# Altium schematic sheet adc-digital.SchDoc: ADC - Digital
size Letter; CheckedBy: J. Brinton; CompanyName: Signal Laboratories, Inc.; DrawnBy: J. Brinton; Engineer: J. Brinton; Address1: 3479 Edison Way; Address2: Menlo Park CA 94025; Address3: +1 (877) 778-8435; Address4: siglabs.com; Revision: 3; SheetNumber: 19; SheetTotal: 49
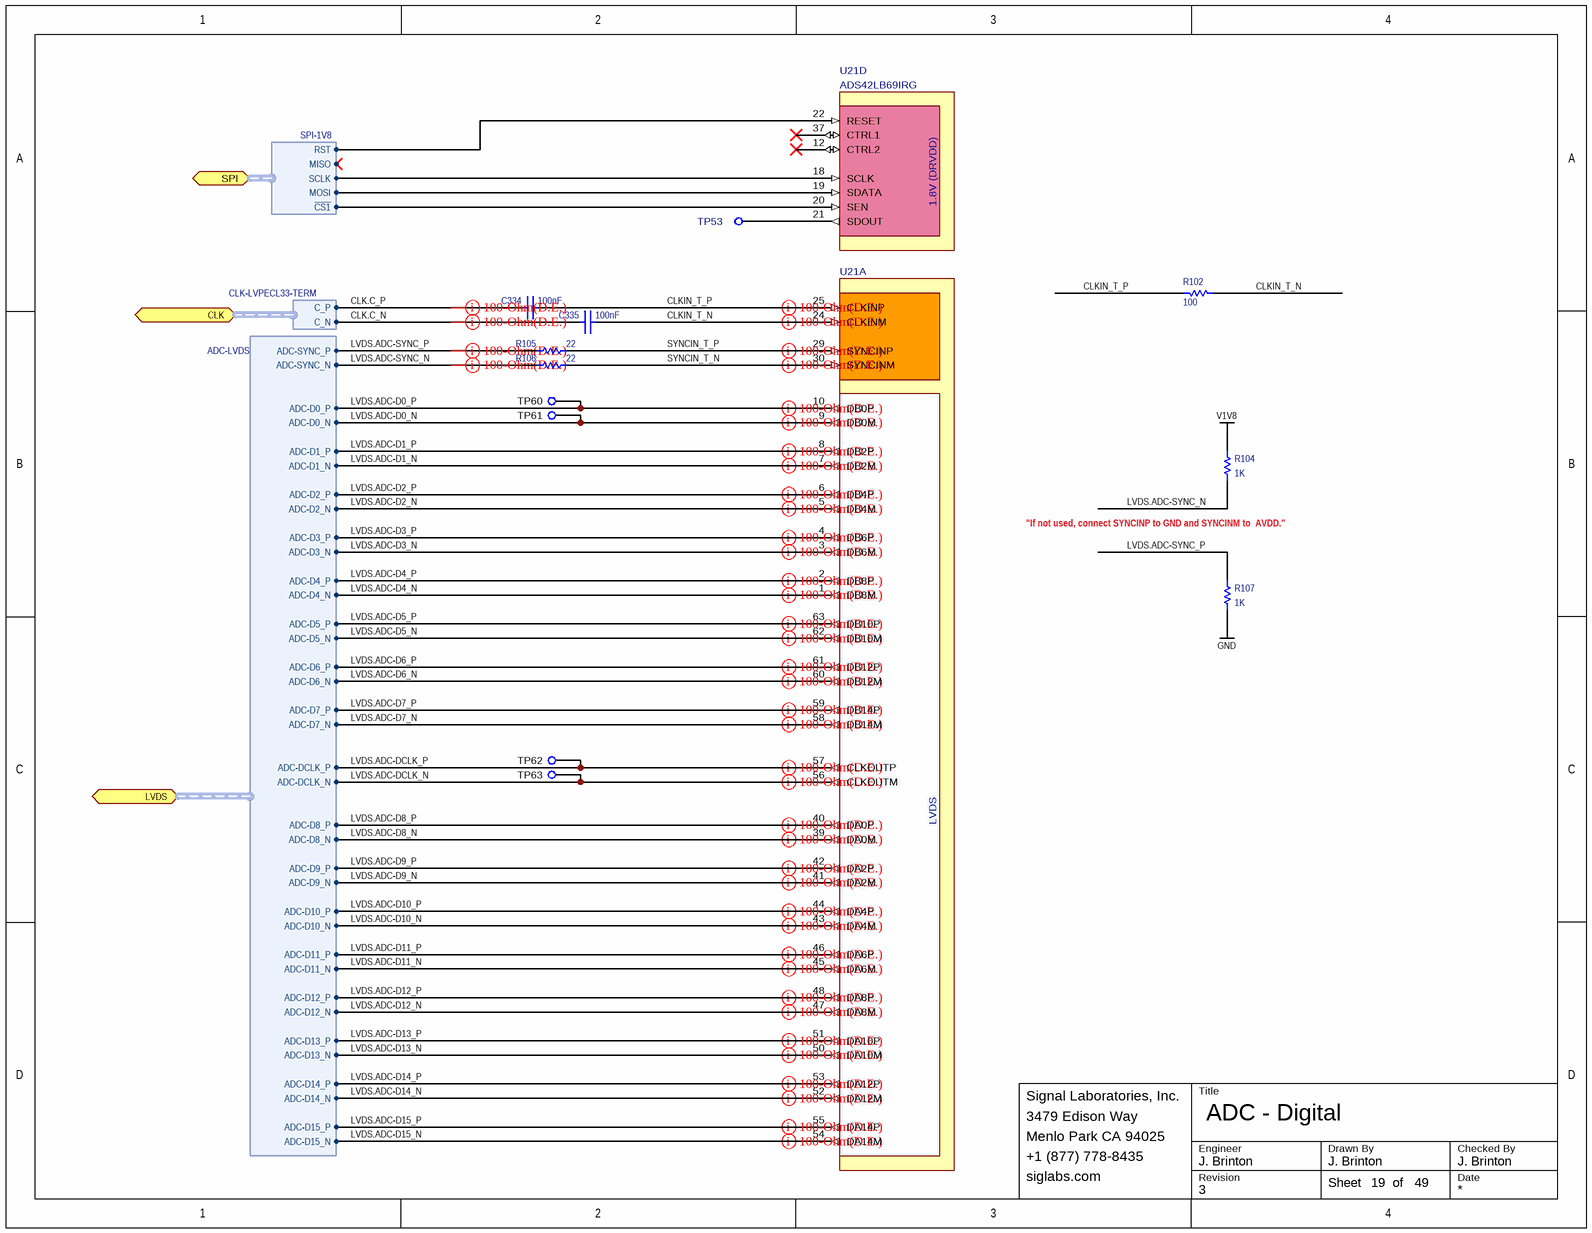
[diagram p0: adc-digital.SchDoc]

## Parts
C334  value 100nF  [CAPC100X50X55L25N]  (hidden comment: GRM155R71C104KA88J)
C335  value 100nF  [CAPC100X50X55L25N]  (hidden comment: GRM155R71C104KA88J)
R102  value 100  [RESC1005X40N]  (hidden comment: ERA-2AEB101X)
R104  value 1K  [RESC1005X40N]  (hidden comment: RC0402FR-071KL)
R105  value 22  [RESC1005X40N]  (hidden comment: RC0402FR-0722RL)
R106  value 22  [RESC1005X40N]  (hidden comment: RC0402FR-0722RL)
R107  value 1K  [RESC1005X40N]  (hidden comment: RC0402FR-071KL)
TP53  TEST_POINT_SMD_50  [TEST_POINT_SMD_10]  (value not drawn)  (no BOM)
TP60  TEST_POINT_SMD_50  [TEST_POINT_SMD_10]  (value not drawn)  (no BOM)
TP61  TEST_POINT_SMD_50  [TEST_POINT_SMD_10]  (value not drawn)  (no BOM)
TP62  TEST_POINT_SMD_50  [TEST_POINT_SMD_10]  (value not drawn)  (no BOM)
TP63  TEST_POINT_SMD_50  [TEST_POINT_SMD_10]  (value not drawn)  (no BOM)
U21  ADS42LB69IRG  [S-PVQFN-N64]  (value not drawn)  (parts A,D of 4)

## Ports
CLK (harness CLK-LVPECL33-TERM), LVDS (harness ADC-LVDS), SPI (harness SPI-1V8)

## Harnesses
ADC-LVDS: ADC-D0_P, ADC-D0_N, ADC-D1_P, ADC-D1_N, ADC-D2_P, ADC-D2_N, ADC-D3_P, ADC-D3_N, ADC-D4_P, ADC-D4_N, ADC-D5_P, ADC-D5_N, ADC-D6_P, ADC-D6_N, ADC-D7_P, ADC-D7_N, ADC-D8_P, ADC-D8_N, ADC-D9_P, ADC-D9_N, ADC-D10_P, ADC-D10_N, ADC-D11_P, ADC-D11_N, ADC-D12_P, ADC-D12_N, ADC-D13_P, ADC-D13_N, ADC-D14_P, ADC-D14_N, ADC-D15_P, ADC-D15_N, ADC-DCLK_P, ADC-DCLK_N, ADC-SYNC_P, ADC-SYNC_N
CLK-LVPECL33-TERM: C_P, C_N
SPI-1V8: MOSI, MISO, SCLK, ~{CS1}, RST

## Nets
GND: R107.1
V1V8: R104.2
CLK.C_N: C335.1 ; port CLK.C_N
CLK.C_P: C334.1 ; port CLK.C_P
CLKIN_T_N: C335.2 R102.2 U21.24(CLKINM)
CLKIN_T_P: C334.2 R102.1 U21.25(CLKINP)
LVDS.ADC-D0_N: TP61.1 U21.9(DB0M) ; port LVDS.ADC-D0_N
LVDS.ADC-D0_P: TP60.1 U21.10(DB0P) ; port LVDS.ADC-D0_P
LVDS.ADC-D1_N: U21.7(DB2M) ; port LVDS.ADC-D1_N
LVDS.ADC-D1_P: U21.8(DB2P) ; port LVDS.ADC-D1_P
LVDS.ADC-D2_N: U21.5(DB4M) ; port LVDS.ADC-D2_N
LVDS.ADC-D2_P: U21.6(DB4P) ; port LVDS.ADC-D2_P
LVDS.ADC-D3_N: U21.3(DB6M) ; port LVDS.ADC-D3_N
LVDS.ADC-D3_P: U21.4(DB6P) ; port LVDS.ADC-D3_P
LVDS.ADC-D4_N: U21.1(DB8M) ; port LVDS.ADC-D4_N
LVDS.ADC-D4_P: U21.2(DB8P) ; port LVDS.ADC-D4_P
LVDS.ADC-D5_N: U21.62(DB10M) ; port LVDS.ADC-D5_N
LVDS.ADC-D5_P: U21.63(DB10P) ; port LVDS.ADC-D5_P
LVDS.ADC-D6_N: U21.60(DB12M) ; port LVDS.ADC-D6_N
LVDS.ADC-D6_P: U21.61(DB12P) ; port LVDS.ADC-D6_P
LVDS.ADC-D7_N: U21.58(DB14M) ; port LVDS.ADC-D7_N
LVDS.ADC-D7_P: U21.59(DB14P) ; port LVDS.ADC-D7_P
LVDS.ADC-D8_N: U21.39(DA0M) ; port LVDS.ADC-D8_N
LVDS.ADC-D8_P: U21.40(DA0P) ; port LVDS.ADC-D8_P
LVDS.ADC-D9_N: U21.41(DA2M) ; port LVDS.ADC-D9_N
LVDS.ADC-D9_P: U21.42(DA2P) ; port LVDS.ADC-D9_P
LVDS.ADC-D10_N: U21.43(DA4M) ; port LVDS.ADC-D10_N
LVDS.ADC-D10_P: U21.44(DA4P) ; port LVDS.ADC-D10_P
LVDS.ADC-D11_N: U21.45(DA6M) ; port LVDS.ADC-D11_N
LVDS.ADC-D11_P: U21.46(DA6P) ; port LVDS.ADC-D11_P
LVDS.ADC-D12_N: U21.47(DA8M) ; port LVDS.ADC-D12_N
LVDS.ADC-D12_P: U21.48(DA8P) ; port LVDS.ADC-D12_P
LVDS.ADC-D13_N: U21.50(DA10M) ; port LVDS.ADC-D13_N
LVDS.ADC-D13_P: U21.51(DA10P) ; port LVDS.ADC-D13_P
LVDS.ADC-D14_N: U21.52(DA12M) ; port LVDS.ADC-D14_N
LVDS.ADC-D14_P: U21.53(DA12P) ; port LVDS.ADC-D14_P
LVDS.ADC-D15_N: U21.54(DA14M) ; port LVDS.ADC-D15_N
LVDS.ADC-D15_P: U21.55(DA14P) ; port LVDS.ADC-D15_P
LVDS.ADC-DCLK_N: TP63.1 U21.56(CLKOUTM) ; port LVDS.ADC-DCLK_N
LVDS.ADC-DCLK_P: TP62.1 U21.57(CLKOUTP) ; port LVDS.ADC-DCLK_P
LVDS.ADC-SYNC_N: R104.1 R106.1 ; port LVDS.ADC-SYNC_N
LVDS.ADC-SYNC_P: R105.1 R107.2 ; port LVDS.ADC-SYNC_P
SYNCIN_T_N: R106.2 U21.30(SYNCINM)
SYNCIN_T_P: R105.2 U21.29(SYNCINP)
NetTP53_1: TP53.1 U21.21(SDOUT)
NetU21_18: U21.18(SCLK) ; port SPI.SCLK
NetU21_19: U21.19(SDATA) ; port SPI.MOSI
NetU21_20: U21.20(SEN) ; port SPI.~{CS1}
NetU21_22: U21.22(RESET) ; port SPI.RST

Not connected (* = marked no-connect by the designer): U21 12(CTRL2)* 37(CTRL1)*

## Layout directives
differential pair; net class z100diff12; Name: 100-Ohm(D.E.): CLK.C_N, CLK.C_P, CLKIN_T_N, CLKIN_T_P, LVDS.ADC-D0_N, LVDS.ADC-D0_P, LVDS.ADC-D1_N, LVDS.ADC-D1_P, LVDS.ADC-D2_N, LVDS.ADC-D2_P, LVDS.ADC-D3_N, LVDS.ADC-D3_P, LVDS.ADC-D4_N, LVDS.ADC-D4_P, LVDS.ADC-D5_N, LVDS.ADC-D5_P, LVDS.ADC-D6_N, LVDS.ADC-D6_P, LVDS.ADC-D7_N, LVDS.ADC-D7_P, LVDS.ADC-D8_N, LVDS.ADC-D8_P, LVDS.ADC-D9_N, LVDS.ADC-D9_P, LVDS.ADC-D10_N, LVDS.ADC-D10_P, LVDS.ADC-D11_N, LVDS.ADC-D11_P, LVDS.ADC-D12_N, LVDS.ADC-D12_P, LVDS.ADC-D13_N, LVDS.ADC-D13_P, LVDS.ADC-D14_N, LVDS.ADC-D14_P, LVDS.ADC-D15_N, LVDS.ADC-D15_P, LVDS.ADC-DCLK_N, LVDS.ADC-DCLK_P, LVDS.ADC-SYNC_N, LVDS.ADC-SYNC_P, SYNCIN_T_N, SYNCIN_T_P

## Notes on the sheet
- "If not used, connect SYNCINP to GND and SYNCINM to  AVDD."
- Title
- Engineer
- Revision
- Drawn By
- Checked By
- Date
- Sheet
- of
- (in symbol ADS42LB69IRG, part A) LVDS
- (in symbol ADS42LB69IRG, part D) 1.8V (DRVDD)

## Library data of the parts
C334 C335 = CAP 0402: Ceramic Capacitor 100nF ±10% 16V X7R 0402; Manufacturer: Murata; Tr: -55:125; Voltage: 16V; Manufacturer P/N: GRM155R71C104KA88J; Package: 0402; Tolerance: ±10%
R102 = RES 0402: Thin Film Resistor 100 ±0.1% 0402; Manufacturer: Panasonic; Tr: -55:155; Package: 0402; Manufacturer P/N: ERA-2AEB101X; Do Not Place: *; Tolerance: ±0.1%
R104 R107 = RES 0402: Thick Film Resistor 1k ±1% 0402; Manufacturer: Yageo; Tr: -55:155; Package: 0402; Manufacturer P/N: RC0402FR-071KL; Do Not Place: *; Tolerance: ±1%
R105 R106 = RES 0402: Thick Film Resistor 22 ±1% 0402; Manufacturer: Yageo; Tr: -55:155; Package: 0402; Manufacturer P/N: RC0402FR-0722RL; Do Not Place: *; Tolerance: ±1%
TP53 TP60-TP63 = TEST_POINT_SMD_50: Test Point SMD
U21 = ADS42LB69IRG: Dual-Channel, 16-Bit, 250-MSPS Analog-to-Digital Converter; Manufacturer: Texas Instruments; Manufacturer P/N: ADS42LB69IRG